# EAGLE design sensori di liena (EAGLE 9.2.2)
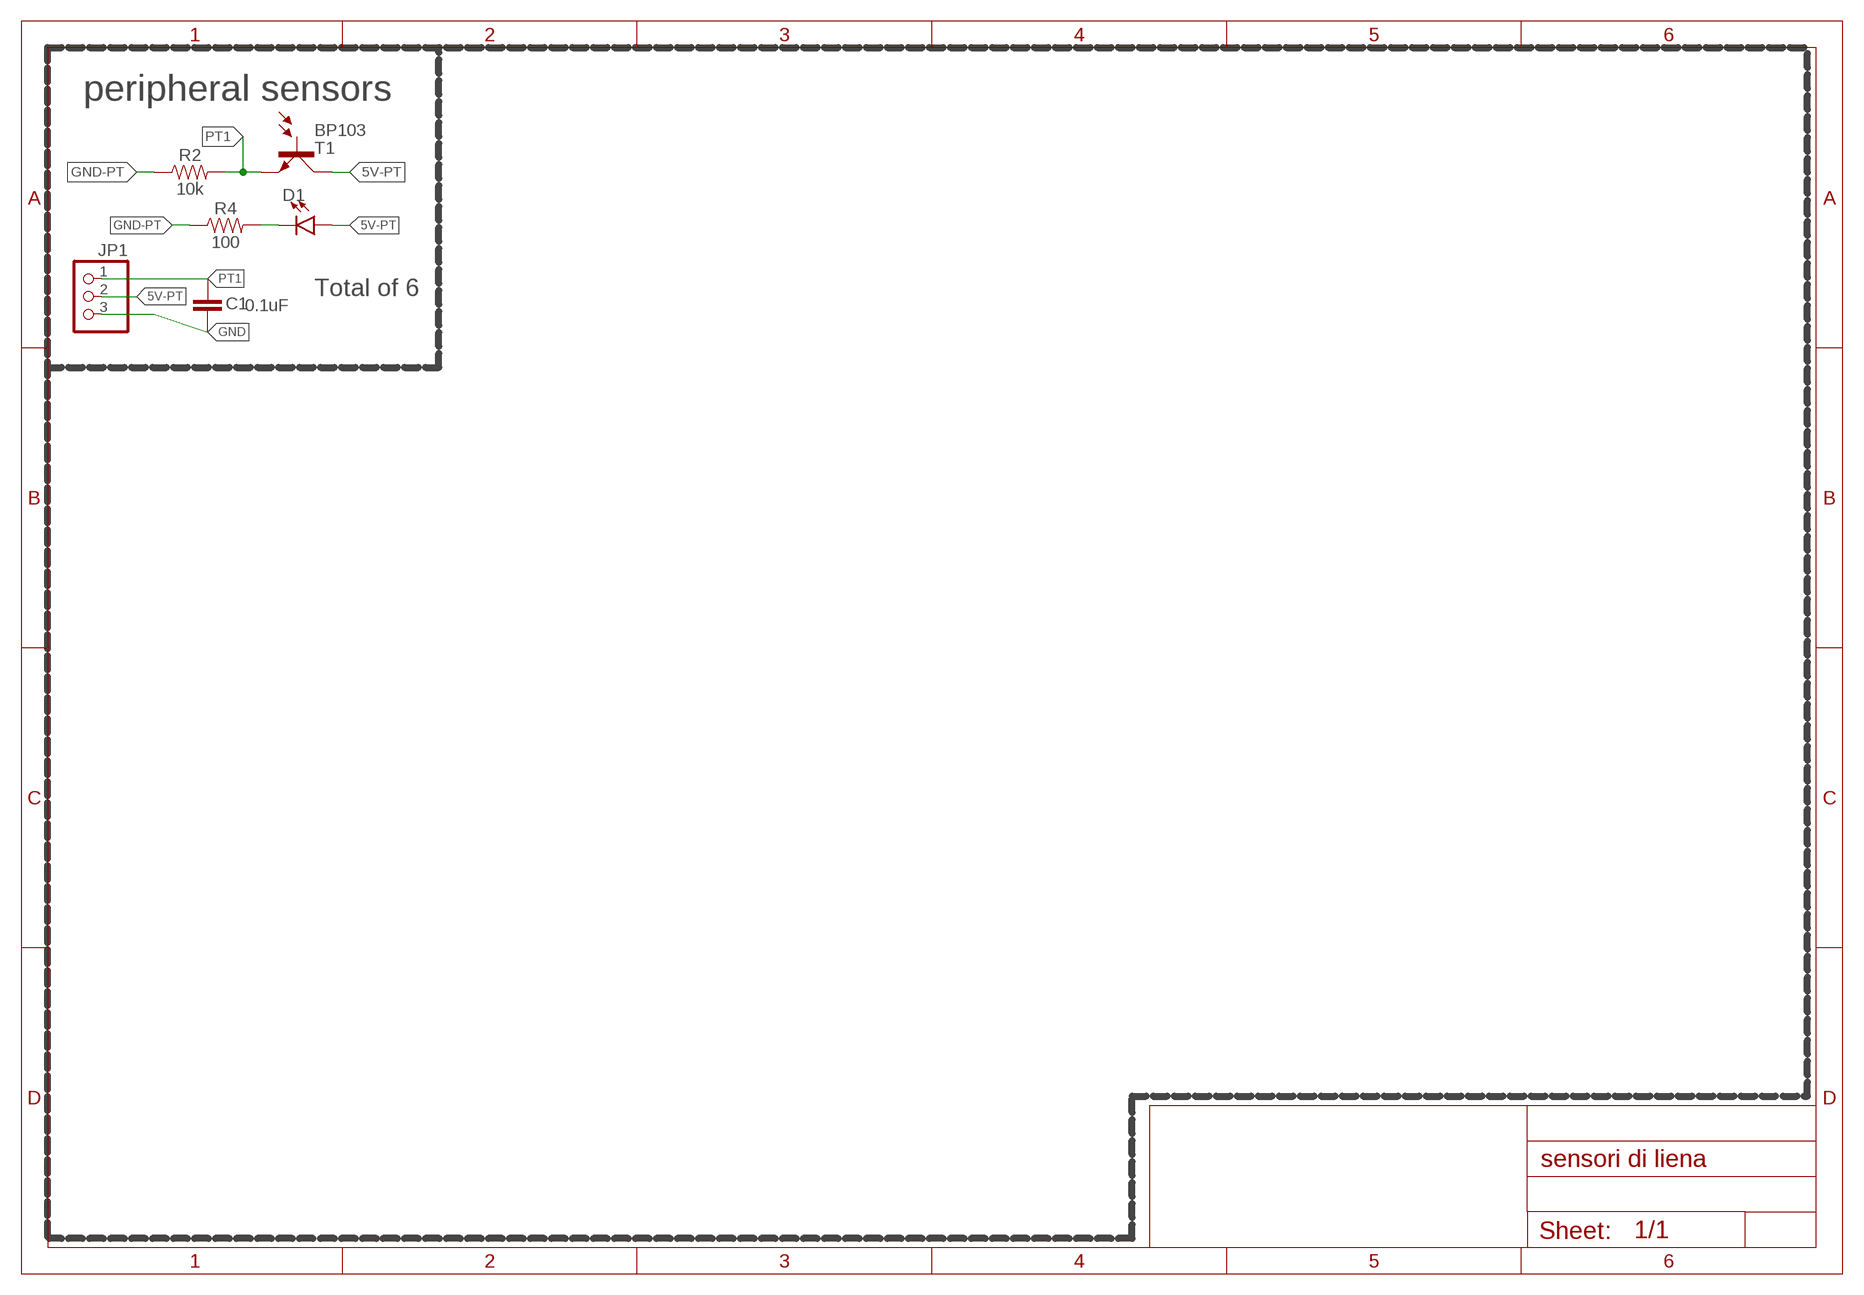
[diagram p0: schematic, sheet 1]

## Parts
C1  0.1uF  0.1UF-KIT-EZ-50V-20%  [CAP-PTH-SMALL-KIT]
D1  LED3MM  [LED_3MM]
JP1  PINHD-1X3  [1X03]
R2  10k  10KOHM-0603-1/10W-1%  [0603]
R4  100  10KOHM-0603-1/10W-1%  [0603]
T1  BP103  [BP103]

## Nets
5V-PT: D1.A JP1.2 T1.C
GND: C1.2 JP1.3
GND-PT: R2.1 R4.1
N$2: D1.K(C) R4.2
PT1: C1.1 JP1.1 R2.2 T1.E
Unconnected: T1.B

## Notes on the sheet
- peripheral sensors
- Total of 6

## Library data of the parts
C1 = SparkFun-Capacitors:0.1UF: 0.1µF ceramic capacitors A capacitor is a passive two-terminal electrical component used to store electrical energy temporarily in an electric field.; PROD_ID: CAP-08370
D1 = SparkFun-LED:LED: LED (Generic) Standard schematic elements and footprints for 5mm, 3mm, 1206, and 0603 sized LEDs. Generic LEDs with no color specified.; PROD_ID: DIO-08794
JP1 = pinhead:PINHD-1X3: PIN HEADER
R2 = SparkFun-Resistors:10KOHM: 10kΩ resistor A resistor is a passive two-terminal electrical component that implements electrical resistance as a circuit element. Resistors act to reduce current flow, and, at the same time, act to lower voltage levels within circuits. - Wikipedia; PROD_ID: RES-00824
R4 = SparkFun-Resistors:10KOHM: 10kΩ resistor A resistor is a passive two-terminal electrical component that implements electrical resistance as a circuit element. Resistors act to reduce current flow, and, at the same time, act to lower voltage levels within circuits. - Wikipedia; PROD_ID: RES-00824; VALUE: 10k
T1 = opto-trans-siemens:BP103: PHOTO TRANSISTOR; OC_FARNELL: unknown; OC_NEWARK: unknown

## Net classes
0 5v: width 0.508 mm, clearance 0.152 mm

## Board
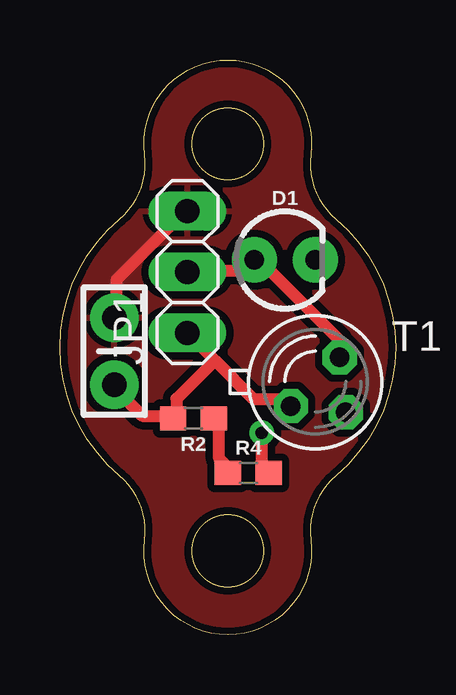
[diagram p1: board, top side]
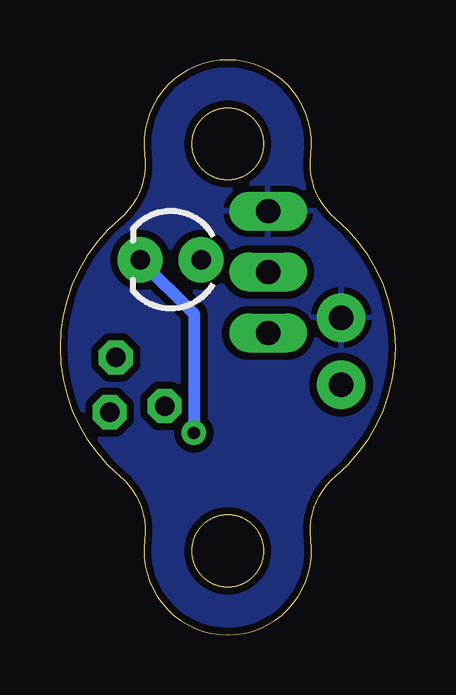
[diagram p2: board, bottom side, seen from below]

Size 14 x 23.97 mm. Coordinates in mm from the lower left corner, seen from the top.
Outline: 3.53,20.02 arc-195 10.47,20.02 arc57 11.51,17.34 arc-100 11.51,6.63 arc57 10.47,3.95 arc-195 3.53,3.95 arc57 2.49,6.63 arc-100 2.49,17.34 arc57 3.53,20.02
Outline: circle at 7,3.5 radius 1.5
Outline: circle at 7,20.47 radius 1.5
Copper layers (1*16): Top 0.035mm / dielectric 1.5mm / Bottom 0.035mm
Design rules "SparkFun": minimum track width 8mil, minimum drill 20mil, track to track 8mil, track to pad 8mil, pad to pad 8mil, via to via 8mil, smd to smd 8mil, copper to edge 10mil, drill to drill 8mil, minimum pad ring 12mil, minimum via ring 10mil, stop-mask expansion 4mil, vias tented up to drill 25mil, thermal gap 10mil

### Footprints (pad centres in the part's own frame; a part is rotated, then mirrored left to right if it is on the bottom)
CAP-PTH-SMALL-KIT = drill 1.016 pad 2.032: 1 -1.397,0; 2 1.397,0
LED_3MM = drill 0.813 pad 1.88: A -1.27,0; K 1.27,0
1X03 = drill 1.016 long: 1 -2.54,0; 2 0,0; 3 2.54,0
0603 = smd 1.1 x 1: 1 -0.85,0; 2 0.85,0
BP103 = drill 0.813 octagon: B 1.27,-1.27; C 1.016,1.016; E -1.016,-1.016

### Placement (x,y rotation side)
C1  2.27,11.83 90 top
D1  9.38,15.64 0 top
JP1  5.32,15.13 90 top
R2  5.57,9.03 180 top
R4  7.86,6.75 0 top
T1  10.65,10.56 0 top

### Tracks (layer width: path | path; a pad name or v marks a point on that pad's centre or on a via)
5V-PT
  Top 0.508: T1.C 11.62,11.62 11.62,12.33 8.42,15.53 D1.A 8.42,15.18 5.57,15.18 JP1.2
GND
  Top 0.508: JP1.3 5.21,17.67 2.37,14.82 2.37,13.4 C1.2
  pour Top (isolate 0.305): -12.21,30.11 -12.21,-4.68 29.95,-4.68 29.95,30.11
  pour Bottom (isolate 0.305): -7.13,26.81 -7.13,-1.89 21.83,-1.89 21.83,26.81
GND-PT
  Top 0.508: R2.1 6.64,8.78 6.64,7.36 6.99,7 R4.1
N$2  (via drill 0.51)
  Top 0.508: v8.42,8.42 8.42,7 R4.2
  Bottom 0.508: v8.42,8.42 8.42,13.4 D1.K
PT1
  Top 0.508: C1.1 2.37,10.2 3.44,9.13 4.5,9.13 R2.2 4.86,9.13 4.86,9.84 6.46,11.44 | JP1.1 6.46,11.44 | 6.46,11.44 8.06,9.84 9.48,9.84 T1.E